# EAGLE design EtchaSketch (EAGLE 9.6.2)
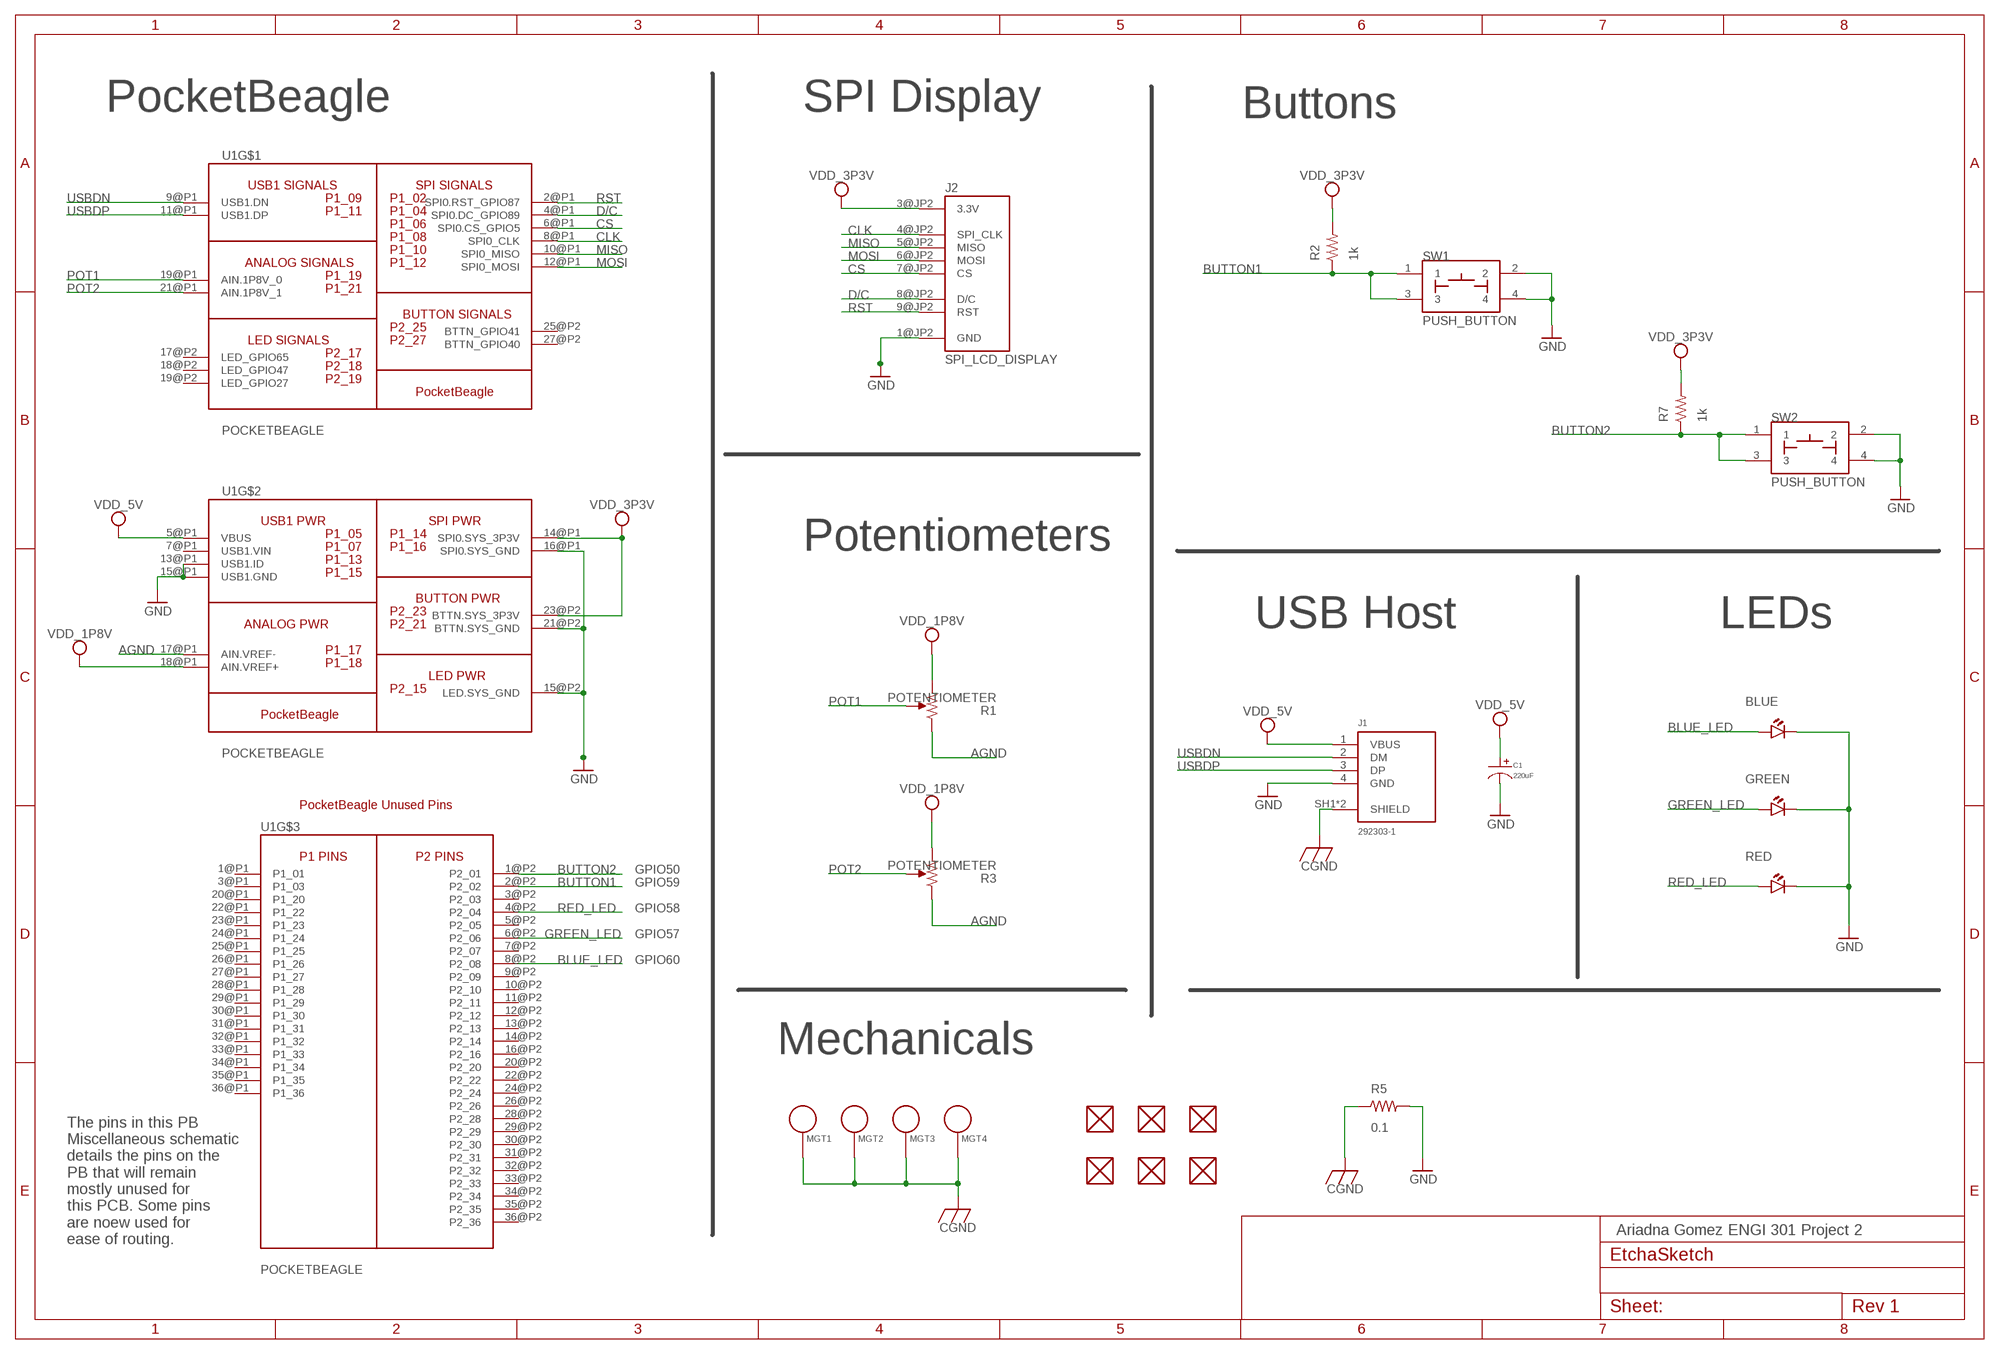
[diagram p0: schematic, sheet 1]

## Parts
BLUE  LED  [EIA-STD]
C1  220uF  CAPACITOR_P_10MM  [CP10MM]
FUD1  FIDUCIAL  [FIDUCIAL_40MIL]
FUD2  FIDUCIAL  [FIDUCIAL_40MIL]
FUD3  FIDUCIAL  [FIDUCIAL_40MIL]
FUD4  FIDUCIAL  [FIDUCIAL_40MIL]
FUD5  FIDUCIAL  [FIDUCIAL_40MIL]
FUD6  FIDUCIAL  [FIDUCIAL_40MIL]
GREEN  LED  [EIA-STD]
J1  292303-1  [TE_292303-1]
J2  SPI_LCD_DISPLAY  [SPI_LCD_DISPLAY]
MGT1  MOUNTING_HOLE  [MOUNTING_HOLE]
MGT2  MOUNTING_HOLE  [MOUNTING_HOLE]
MGT3  MOUNTING_HOLE  [MOUNTING_HOLE]
MGT4  MOUNTING_HOLE  [MOUNTING_HOLE]
R1  POTENTIOMETER  [POT-PO90S]
R2  1k  R_R0603  [R0603]
R3  POTENTIOMETER  [POT-PO90S]
R5  0.1  R_R0805  [R0805]
R7  1k  R_R0603  [R0603]
RED  LED  [EIA-STD]
SW1  PUSH_BUTTON  [BUTTON_12.5MM]
SW2  PUSH_BUTTON  [BUTTON_12.5MM]
U1  POCKETBEAGLE  [POCKETBEAGLE]

## Nets
AGND: R1.CCW R3.CCW U1.17@P1(AIN.VREF-)
BLUE_LED: BLUE.ANODE U1.8@P2(P2_08)
BUTTON1: R2.1 SW1.1 SW1.3 U1.2@P2(P2_02)
BUTTON2: R7.1 SW2.1 SW2.3 U1.1@P2(P2_01)
CGND: J1.SH1(SHIELD) J1.SH2(SHIELD) MGT1.P$1 MGT2.P$1 MGT3.P$1 MGT4.P$1 R5.1
CLK: J2.4@JP2(SPI_CLK) U1.8@P1(SPI0_CLK)
CS: J2.7@JP2(CS) U1.6@P1(SPI0.CS_GPIO5)
D/C: J2.8@JP2(D/C) U1.4@P1(SPI0.DC_GPIO89)
GND: BLUE.CATHODE C1.P$2 GREEN.CATHODE J1.4(GND) J2.1@JP2(GND) R5.2 RED.CATHODE SW1.2 SW1.4 SW2.2 SW2.4 U1.13@P1(USB1.ID) U1.15@P1(USB1.GND) U1.15@P2(LED.SYS_GND) U1.16@P1(SPI0.SYS_GND) U1.21@P2(BTTN.SYS_GND)
GREEN_LED: GREEN.ANODE U1.6@P2(P2_06)
MISO: J2.5@JP2(MISO) U1.10@P1(SPI0_MISO)
MOSI: J2.6@JP2(MOSI) U1.12@P1(SPI0_MOSI)
POT1: R1.S U1.19@P1(AIN.1P8V_0)
POT2: R3.S U1.21@P1(AIN.1P8V_1)
RED_LED: RED.ANODE U1.4@P2(P2_04)
RST: J2.9@JP2(RST) U1.2@P1(SPI0.RST_GPIO87)
USBDN: J1.2(DM) U1.9@P1(USB1.DN)
USBDP: J1.3(DP) U1.11@P1(USB1.DP)
VDD_1P8V: R1.CW R3.CW U1.18@P1(AIN.VREF+)
VDD_3P3V: J2.3@JP2(3.3V) R2.2 R7.2 U1.14@P1(SPI0.SYS_3P3V) U1.23@P2(BTTN.SYS_3P3V)
VDD_5V: C1.P$1 J1.1(VBUS) U1.5@P1(VBUS)
Unconnected: FUD1.P$1 FUD2.P$1 FUD3.P$1 FUD4.P$1 FUD5.P$1 FUD6.P$1 U1.1@P1(P1_01) U1.3@P1(P1_03) U1.3@P2(P2_03) U1.5@P2(P2_05) U1.7@P1(USB1.VIN) U1.7@P2(P2_07) U1.9@P2(P2_09) U1.10@P2(P2_10) U1.11@P2(P2_11) U1.12@P2(P2_12) U1.13@P2(P2_13) U1.14@P2(P2_14) U1.16@P2(P2_16) U1.17@P2(LED_GPIO65) U1.18@P2(LED_GPIO47) U1.19@P2(LED_GPIO27) U1.20@P1(P1_20) U1.20@P2(P2_20) U1.22@P1(P1_22) U1.22@P2(P2_22) U1.23@P1(P1_23) U1.24@P1(P1_24) U1.24@P2(P2_24) U1.25@P1(P1_25) U1.25@P2(BTTN_GPIO41) U1.26@P1(P1_26) U1.26@P2(P2_26) U1.27@P1(P1_27) U1.27@P2(BTTN_GPIO40) U1.28@P1(P1_28) U1.28@P2(P2_28) U1.29@P1(P1_29) U1.29@P2(P2_29) U1.30@P1(P1_30) U1.30@P2(P2_30) U1.31@P1(P1_31) U1.31@P2(P2_31) U1.32@P1(P1_32) U1.32@P2(P2_32) U1.33@P1(P1_33) U1.33@P2(P2_33) U1.34@P1(P1_34) U1.34@P2(P2_34) U1.35@P1(P1_35) U1.35@P2(P2_35) U1.36@P1(P1_36) U1.36@P2(P2_36)

## Notes on the sheet
- PocketBeagle | SPI Display | Buttons
- Potentiometers
- USB Host | LEDs
- GPIO50
- GPIO59
- GPIO58
- GPIO57
- GPIO60
- Mechanicals
- Ariadna Gomez ENGI 301 Project 2
- The pins in this PB 
  Miscellaneous schematic 
  details the pins on the
  PB that will remain
  mostly unused for 
  this PCB. Some pins 
  are noew used for
  ease of routing.

## Library data of the parts
BLUE GREEN RED = EtchaSketch:LED: LTST-C191 TBKT LED
C1 = EtchaSketch:CAPACITOR_P: Library: MF_Passives Description: Device for Polarized Capacitors. Manufacture part number (MPN), Voltage Rating, and Tolerance can be added via Attributes. Check https://factory.macrofab.com/parts for the house parts list.; POPULATE: 1
FUD1-FUD6 = combo_lock:FIDUCIAL
J1 = EtchaSketch:292303-1: CONN USB RECEPT R/A TYPE A 4POS Check prices <https://pricing.snapeda.com/parts/292303-1/TE%20Connectivity/view-part?ref=eda>; AVAILABILITY: In Stock; COMMENT: 292303-1; DESCRIPTION: Conn; Data; USB; Recept; 2.0; 4 Pos; 1 Port; Rt Angle; A Ser; Tin over Copper; MF: TE Connectivity; MP: 292303-1; PACKAGE: None; PRICE: None; PURCHASE-URL: https://pricing.snapeda.com/search/part/292303-1/?ref=eda
J2 = EtchaSketch:SPI_LCD_DISPLAY: 2.8" Adafruit SPI Display https://github.com/adafruit/2.8-TFT-Breakout-PCB
MGT1-MGT4 = combo_lock:MOUNTING_HOLE: Chassis Mounting Hole w/GND connection ability
R1 R3 = EtchaSketch:POTENTIOMETER: Potentiometer - Examples: P090S-14T20BR10K (987-1277-ND)
R2 R7 = EtchaSketch:R_: RESISTOR, American symbol
R5 = combo_lock:R_: RESISTOR, American symbol
SW1 SW2 = EtchaSketch:PUSH_BUTTON
U1 = EtchaSketch:POCKETBEAGLE

## Board
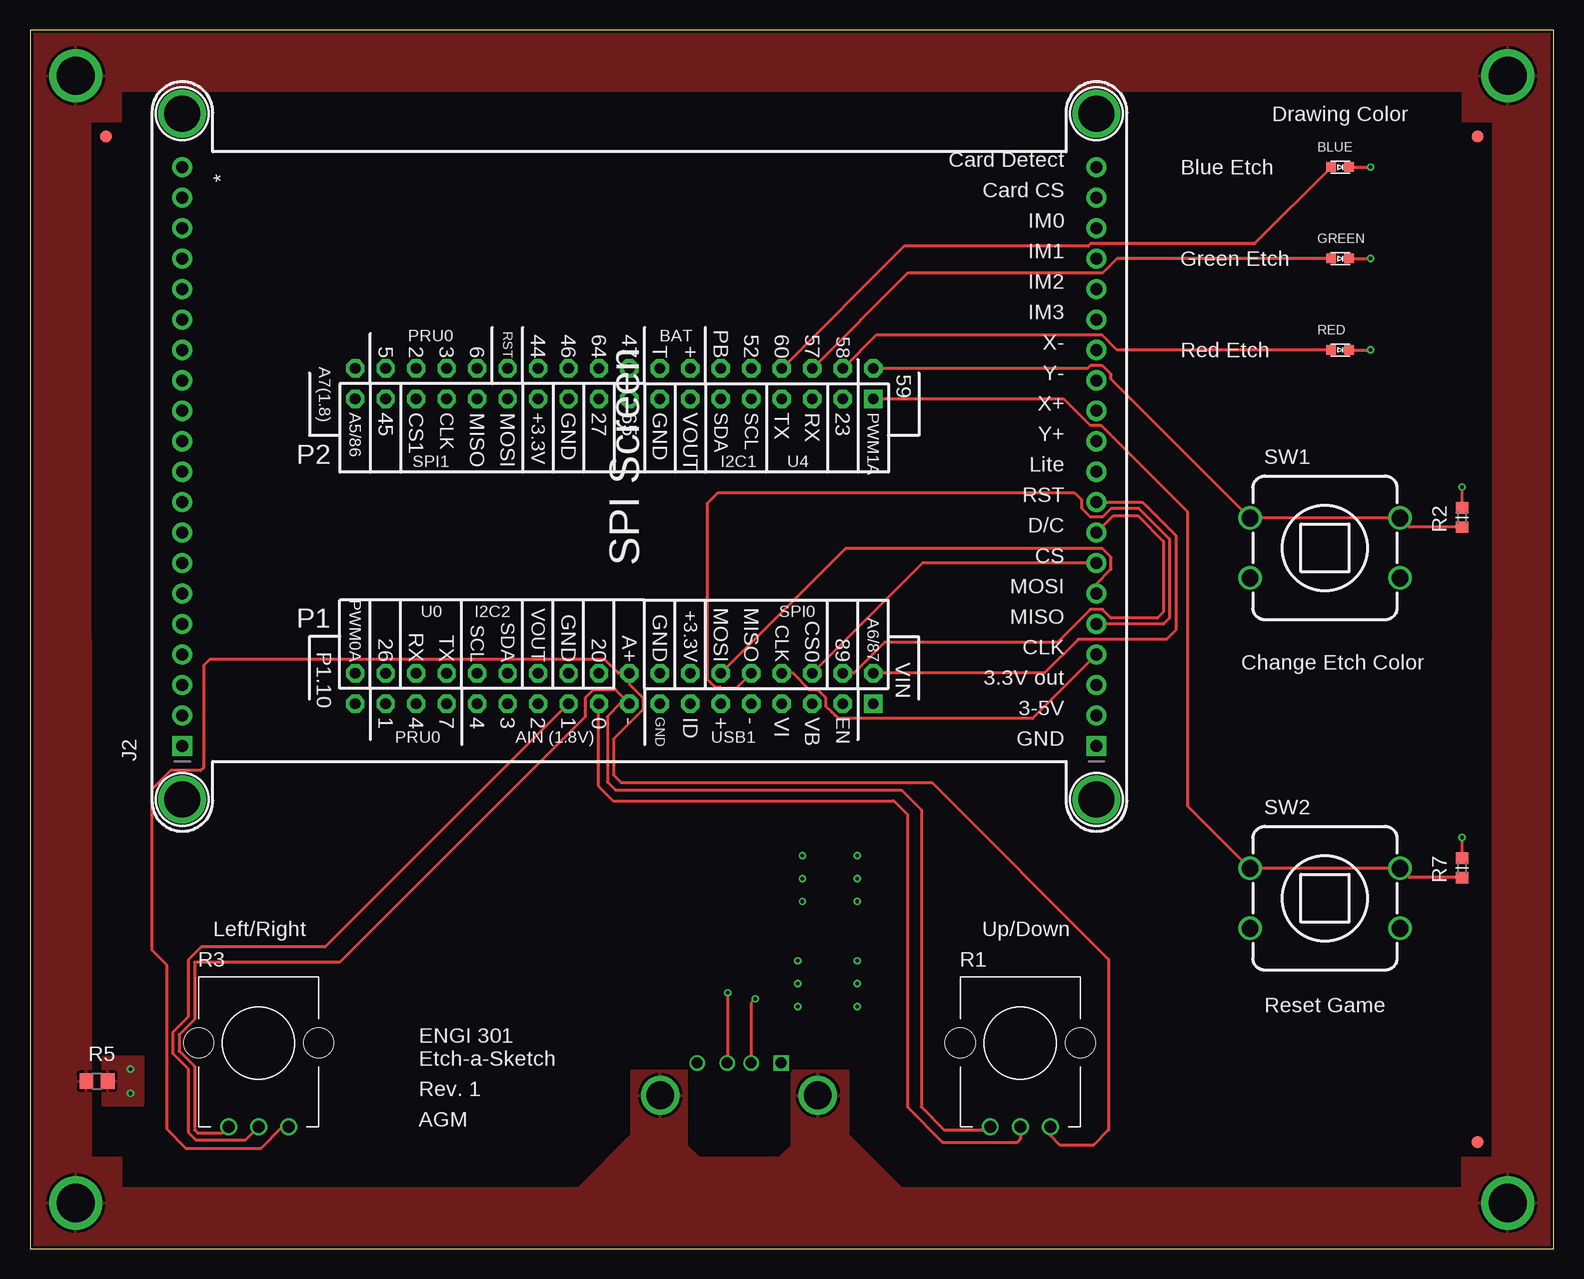
[diagram p1: board, top side]
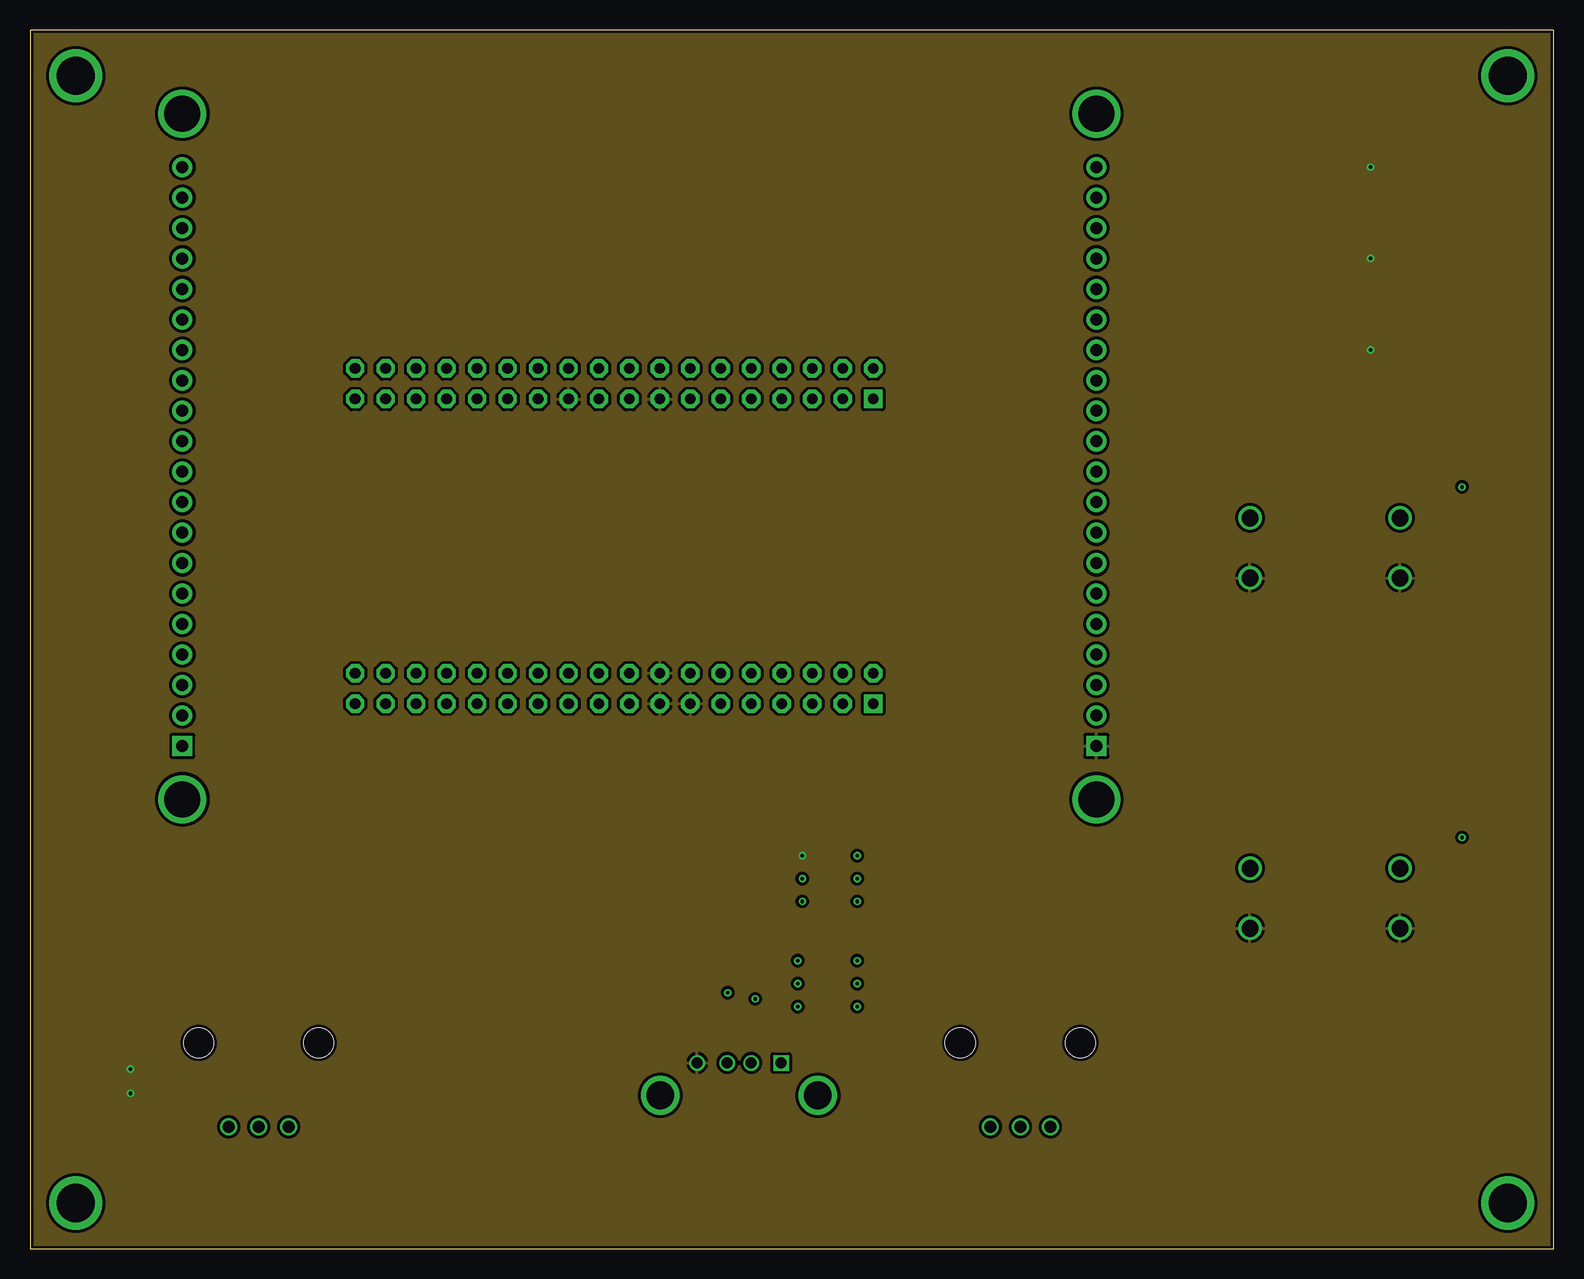
[diagram p2: board, inner layer Route2]
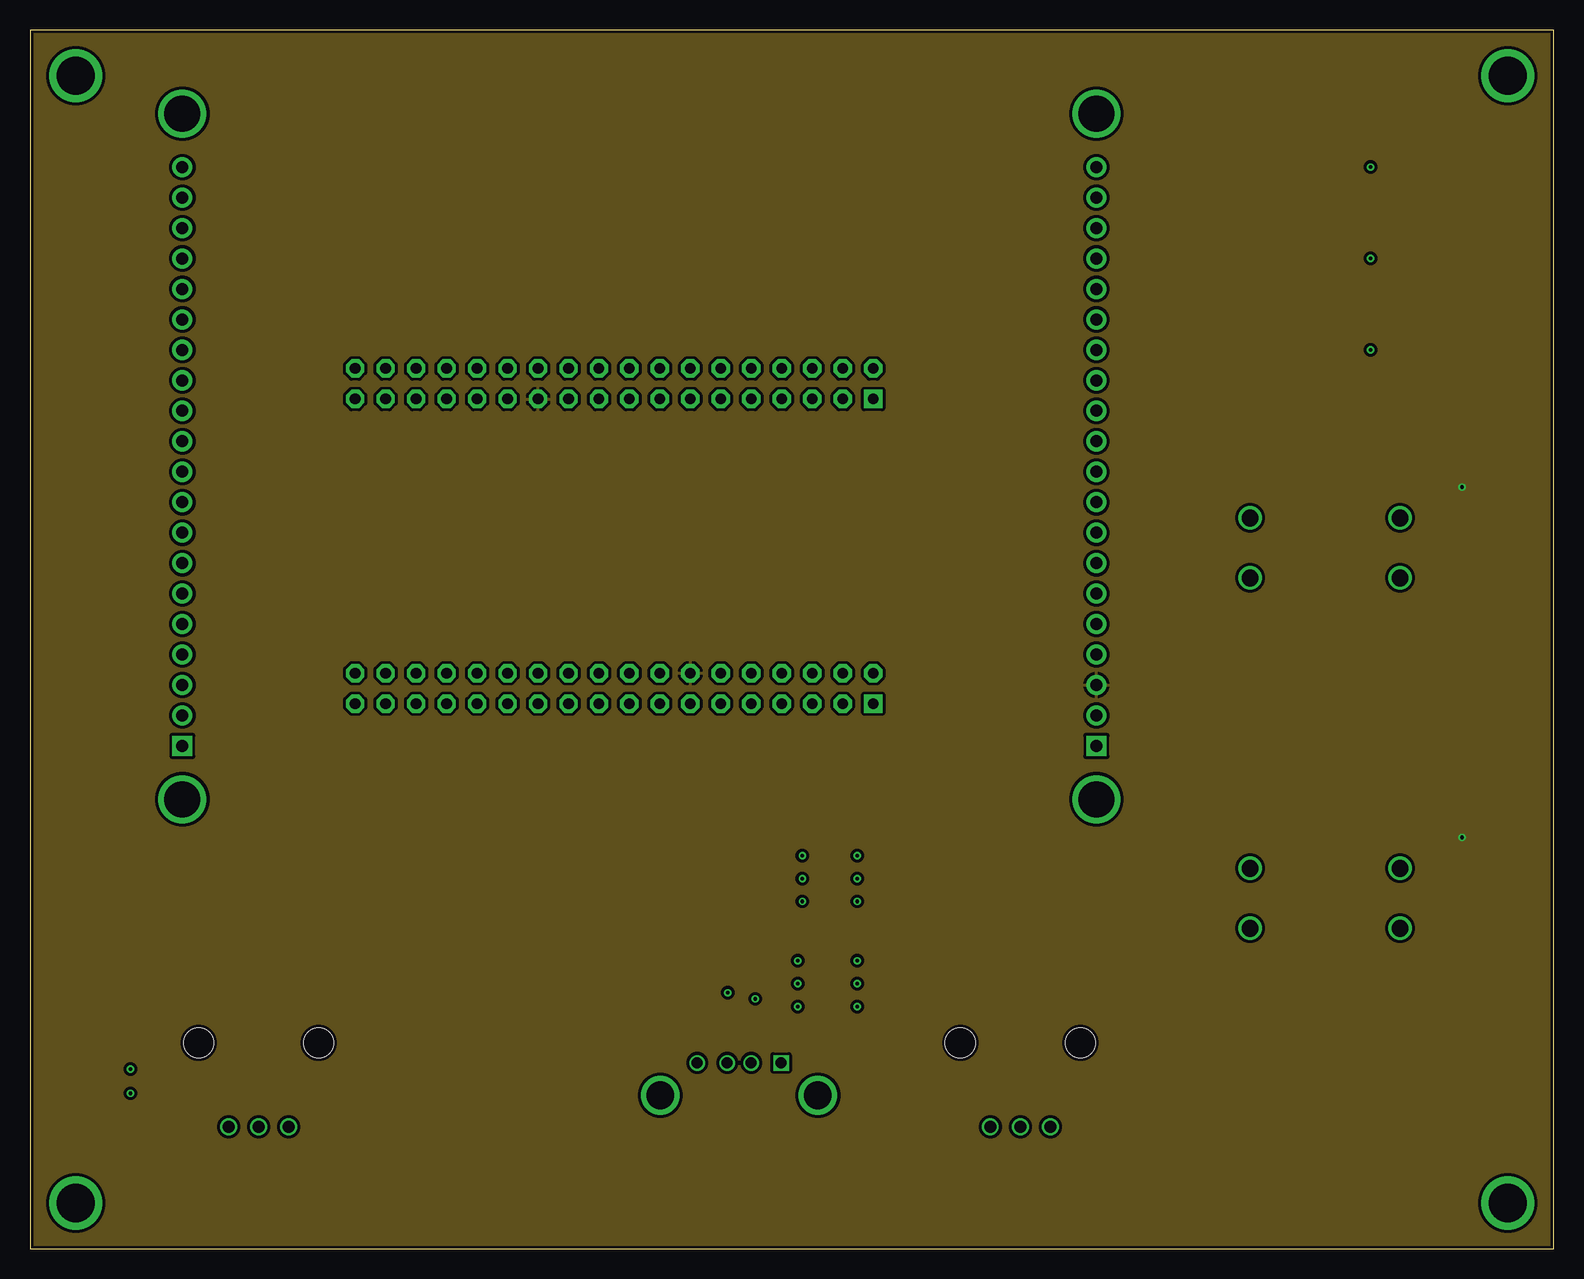
[diagram p3: board, inner layer Route15]
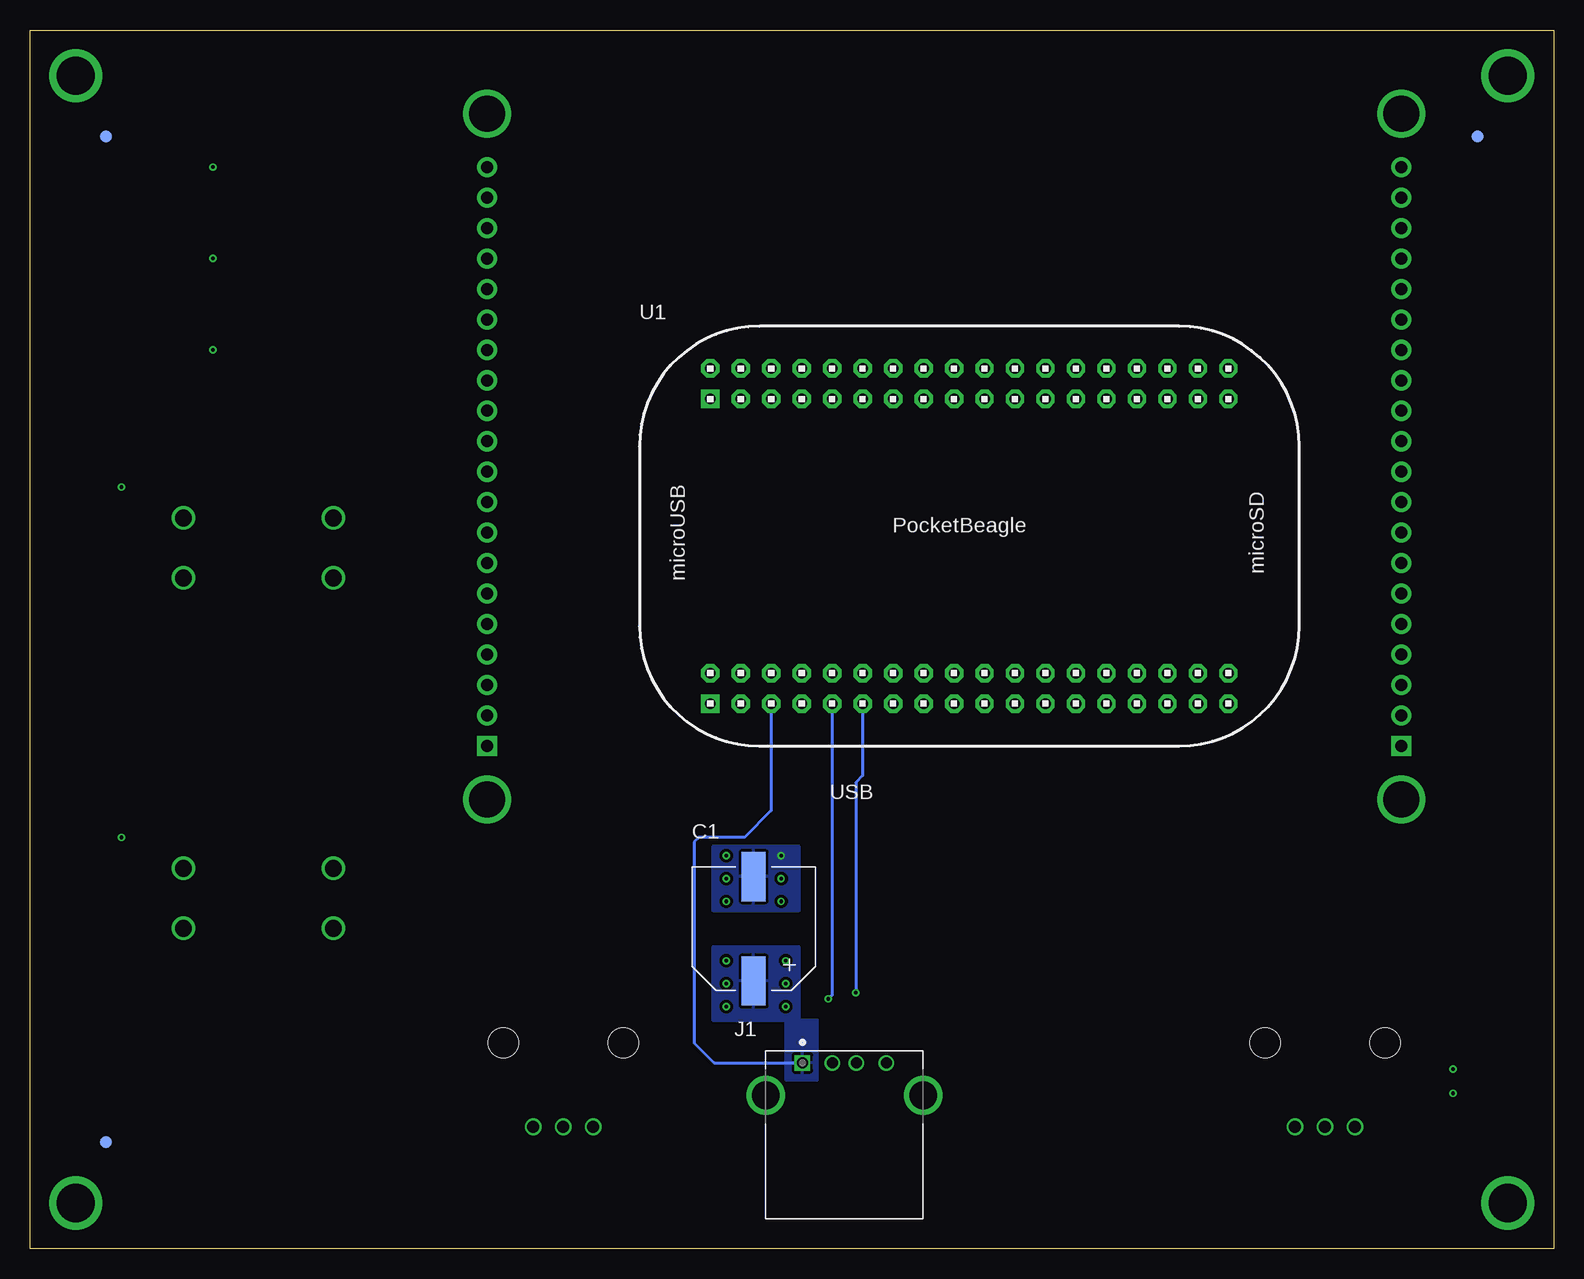
[diagram p4: board, bottom side, seen from below]

Size 127 x 101.6 mm. Coordinates in mm from the lower left corner, seen from the top.
Outline: 0,0 127,0 127,101.6 0,101.6 0,0
Copper layers (1*2*15*16): Top 0.035mm / dielectric 0.23mm / Route2 0.035mm / dielectric 0.93mm / Route15 0.035mm / dielectric 0.23mm / Bottom 0.035mm
Design rules "ENGI301_4lyr": minimum track width 10mil, minimum drill 12mil, track to track 10mil, track to pad 10mil, pad to pad 10mil, via to via 10mil, smd to smd 10mil, copper to edge 10mil, drill to drill 12mil, minimum pad ring 6mil, minimum via ring 6mil, stop-mask expansion 3mil, vias tented up to drill 25mil, thermal gap 10mil

### Footprints (pad centres in the part's own frame; a part is rotated, then mirrored left to right if it is on the bottom)
EIA-STD = smd 0.8 x 0.8: ANODE -0.75,0; CATHODE 0.75,0
CP10MM = smd 2 x 4.1: P$1 0,-4.35; P$2 0,4.35
FIDUCIAL_40MIL = smd 1.016 x 1.016: P$1 0,0
TE_292303-1 = drill 0.92 square: 1 0,0 | drill 0.92: 2 2.5,0; 3 4.5,0; 4 7,0 | drill 2.3: SH1 -3.07,-2.71; SH2 10.07,-2.71
SPI_LCD_DISPLAY = drill 1 pad 1.676 square: 1@JP1 -24.13,38.1; 1@JP2 -24.13,-38.1 | drill 1 pad 1.676: 2@JP1 -21.59,38.1; 2@JP2 -21.59,-38.1; 3@JP1 -19.05,38.1; 3@JP2 -19.05,-38.1; 4@JP1 -16.51,38.1; 4@JP2 -16.51,-38.1; 5@JP1 -13.97,38.1; 5@JP2 -13.97,-38.1; 6@JP1 -11.43,38.1; 6@JP2 -11.43,-38.1; 7@JP1 -8.89,38.1; 7@JP2 -8.89,-38.1; 8@JP1 -6.35,38.1; 8@JP2 -6.35,-38.1; 9@JP1 -3.81,38.1; 9@JP2 -3.81,-38.1; 10@JP1 -1.27,38.1; 10@JP2 -1.27,-38.1; 11@JP1 1.27,38.1; 11@JP2 1.27,-38.1; 12@JP1 3.81,38.1; 12@JP2 3.81,-38.1; 13@JP1 6.35,38.1; 13@JP2 6.35,-38.1; 14@JP1 8.89,38.1; 14@JP2 8.89,-38.1; 15@JP1 11.43,38.1; 15@JP2 11.43,-38.1; 16@JP1 13.97,38.1; 16@JP2 13.97,-38.1; 17@JP1 16.51,38.1; 17@JP2 16.51,-38.1; 18@JP1 19.05,38.1; 18@JP2 19.05,-38.1; 19@JP1 21.59,38.1; 19@JP2 21.59,-38.1; 20@JP1 24.13,38.1; 20@JP2 24.13,-38.1 | drill 3 pad 3.6: P$1@U$7 -28.575,-38.1; P$1@U$15 28.575,-38.1; P$1@U$16 -28.575,38.1; P$1@U$17 28.575,38.1
MOUNTING_HOLE = drill 3.175 pad 4.445: P$1 0,0
POT-PO90S = drill 1: CCW -2.5,0; CW 2.5,0; S 0,0 | hole 2.5: -5,7; 5,7
R0603 = smd 0.95 x 1.031: 1 -0.8,0; 2 0.8,0
R0805 = smd 1.143 x 1.27: 1 -0.889,0; 2 0.889,0
BUTTON_12.5MM = drill 1.4: 1 -6.25,2.5; 2 -6.25,-2.5; 3 6.25,2.5; 4 6.25,-2.5
POCKETBEAGLE = drill 0.889 pad 1.524 square: 1@P1 5.91,3.53; 1@P2 5.91,28.93 | drill 0.889 pad 1.524 octagon: 2@P1 5.91,6.07; 2@P2 5.91,31.47; 3@P1 8.45,3.53; 3@P2 8.45,28.93; 4@P1 8.45,6.07; 4@P2 8.45,31.47; 5@P1 10.99,3.53; 5@P2 10.99,28.93; 6@P1 10.99,6.07; 6@P2 10.99,31.47; 7@P1 13.53,3.53; 7@P2 13.53,28.93; 8@P1 13.53,6.07; 8@P2 13.53,31.47; 9@P1 16.07,3.53; 9@P2 16.07,28.93; 10@P1 16.07,6.07; 10@P2 16.07,31.47; 11@P1 18.61,3.53; 11@P2 18.61,28.93; 12@P1 18.61,6.07; 12@P2 18.61,31.47; 13@P1 21.15,3.53; 13@P2 21.15,28.93; 14@P1 21.15,6.07; 14@P2 21.15,31.47; 15@P1 23.69,3.53; 15@P2 23.69,28.93; 16@P1 23.69,6.07; 16@P2 23.69,31.47; 17@P1 26.23,3.53; 17@P2 26.23,28.93; 18@P1 26.23,6.07; 18@P2 26.23,31.47; 19@P1 28.77,3.53; 19@P2 28.77,28.93; 20@P1 28.77,6.07; 20@P2 28.77,31.47; 21@P1 31.31,3.53; 21@P2 31.31,28.93; 22@P1 31.31,6.07; 22@P2 31.31,31.47; 23@P1 33.85,3.53; 23@P2 33.85,28.93; 24@P1 33.85,6.07; 24@P2 33.85,31.47; 25@P1 36.39,3.53; 25@P2 36.39,28.93; 26@P1 36.39,6.07; 26@P2 36.39,31.47; 27@P1 38.93,3.53; 27@P2 38.93,28.93; 28@P1 38.93,6.07; 28@P2 38.93,31.47; 29@P1 41.47,3.53; 29@P2 41.47,28.93; 30@P1 41.47,6.07; 30@P2 41.47,31.47; 31@P1 44.01,3.53; 31@P2 44.01,28.93; 32@P1 44.01,6.07; 32@P2 44.01,31.47; 33@P1 46.55,3.53; 33@P2 46.55,28.93; 34@P1 46.55,6.07; 34@P2 46.55,31.47; 35@P1 49.09,3.53; 35@P2 49.09,28.93; 36@P1 49.09,6.07; 36@P2 49.09,31.47

### Placement (x,y rotation side)
BLUE  109.22,90.17 0 top
C1  66.67,26.67 0 bottom
FUD1  120.65,8.89 0 top
FUD2  6.35,92.71 0 top
FUD3  120.65,8.89 0 bottom
FUD4  120.65,92.71 0 bottom
FUD5  6.35,92.71 0 bottom
FUD6  120.65,92.71 0 top
GREEN  109.22,82.55 0 top
J1  62.61,15.49 0 bottom
J2  50.8,66.04 90 top
MGT1  3.81,97.79 0 top
MGT2  123.19,3.81 0 top
MGT3  3.81,3.81 0 top
MGT4  123.19,97.79 0 top
R1  82.55,10.16 0 top
R2  119.38,60.96 90 top
R3  19.05,10.16 0 top
R5  5.59,13.97 0 top
R7  119.38,31.75 90 top
RED  109.22,74.93 0 top
SW1  107.95,58.42 0 top
SW2  107.95,29.21 0 top
U1  76.2,41.91 0 bottom

### Tracks (layer width: path | path; a pad name or v marks a point on that pad's centre or on a via)
AGND
  Top 0.254: R3.CCW 16.04,9.65 13.97,9.65 13.72,9.91 13.72,15.19 12.42,16.48 12.42,17.84 13.72,19.13 13.72,23.88 25.81,23.88 46.29,44.35 46.29,45.91 46.96,46.58 48.83,46.58 U1.17@P1 49.21,45.44 48.13,44.37 48.13,38.91 48.81,38.23 72.64,38.23 74.3,36.58 74.3,11.81 76.2,9.91 79.8,9.91 R1.CCW
BLUE_LED
  Top 0.254: BLUE.ANODE 102.07,83.77 88.39,83.77 88.19,83.57 72.86,83.57 U1.8@P2
BUTTON1
  Top 0.254: R2.1 114.96,60.16 SW1.3 SW1.1 90.12,72.5 90.12,72.89 89.41,73.61 88.39,73.61 88.17,73.38 U1.2@P2
BUTTON2
  Top 0.254: R7.1 114.96,30.95 SW2.3 SW2.1 96.52,36.89 96.52,61.41 89.3,68.63 88.39,68.63 86.19,70.84 U1.1@P2
CGND
  pour Top: -2.54,-2.54 -2.54,50.8 5.08,50.8 5.08,7.62 7.62,7.62 7.62,5.08 45.72,5.08 50.16,9.53 50.16,14.86 54.74,14.86 54.74,8.64 55.75,7.62 62.48,7.62 63.5,8.64 63.5,14.86 68.2,14.86 68.2,9.53 72.64,5.08 119.38,5.08 119.38,7.62 121.92,7.62 121.92,50.8 129.54,50.8 129.54,-2.54
  pour Top: -2.54,104.14 -2.54,50.8 5.08,50.8 5.08,93.98 7.62,93.98 7.62,96.52 119.38,96.52 119.38,93.98 121.92,93.98 121.92,50.8 129.54,50.8 129.54,104.14
CLK
  Top 0.254: J2.4@JP2 83.57,44.2 67.38,44.2 67.09,44.48 66.84,44.74 66.35,45.22 66.35,45.91 65.68,46.58 64.99,46.58 63.59,47.98 U1.8@P1
CS
  Top 0.254: J2.7@JP2 74.38,57.15 U1.6@P1
D/C
  Top 0.254: J2.8@JP2 90.32,61.11 92.35,61.11 94.49,58.97 94.49,53.09 93.98,52.58 90.12,52.58 89.41,53.29 88.39,53.29 85.65,50.55 71.24,50.55 68.67,47.98 U1.4@P1
GND  (via drill 0.3 pad 0.61)
  Top 0.254: BLUE.CATHODE v111.76,90.17 | GREEN.CATHODE v111.76,82.55 | RED.CATHODE v111.76,74.93
  other vias: 8.38,12.95 8.38,14.99 64.39,32.77
  pour Route2: -5.08,106.68 132.08,106.68 132.08,-5.08 -5.08,-5.08
  pour Top: 6.1,13.97 6.1,16 9.4,16 9.4,11.94 6.1,11.94
  pour Bottom: 62.87,33.53 70.1,33.53 70.1,28.19 62.87,28.19
GND1  (via drill 0.3 pad 0.61)
  other vias: 64.39,30.86
GND2  (via drill 0.3 pad 0.61)
  other vias: 64.39,28.96
GND3  (via drill 0.3 pad 0.61)
  other vias: 68.96,32.77
GND4  (via drill 0.3 pad 0.61)
  other vias: 68.96,30.86
GND5  (via drill 0.3 pad 0.61)
  other vias: 68.96,28.96
GREEN_LED
  Top 0.254: GREEN.ANODE 90.62,82.55 89.41,81.33 73.16,81.33 U1.6@P2
MISO
  Top 0.254: J2.5@JP2 94.49,52.07 95,52.58 95,59.18 92.46,61.72 90.12,61.72 89.41,61.01 88.39,61.01 87.68,61.73 87.68,62.43 87.12,62.99 57.3,62.99 56.45,62.13 56.45,47.51 57.12,46.84 57.56,46.84 57.66,46.74 58.89,46.74 U1.10@P1
MOSI
  Top 0.254: U1.12@P1 67.98,58.37 89.41,58.37 90.12,57.66 90.12,56.65 88.9,55.43 J2.6@JP2
POT1
  Top 0.254: R1.S 82.55,9.14 82.3,8.89 76.07,8.89 73.15,11.81 73.15,36.2 72.01,37.34 48.6,37.34 47.36,38.58 47.36,45.37 U1.19@P1
POT2
  Top 0.254: U1.21@P1 24.6,25.15 14.27,25.15 13.21,24.09 13.21,19.34 11.91,18.05 11.91,16.27 13.21,14.98 13.21,9.7 13.82,9.08 17.97,9.08 R3.S
RED_LED
  Top 0.254: RED.ANODE 90.62,74.93 89.41,76.15 70.52,76.15 U1.4@P2
RST
  Top 0.254: J2.9@JP2 92.71,62.23 95.5,59.44 95.5,51.56 94.74,50.8 87.38,50.8 84.56,47.98 U1.2@P1
USBDN  (via drill 0.3 pad 0.61)
  Top 0.254: v60.45,20.83 60.11,20.49 J1.2
  Bottom 0.254: v60.45,20.83 60.13,21.15 U1.9@P1
USBDP  (via drill 0.3 pad 0.61)
  Top 0.254: v58.17,21.34 58.17,15.55 J1.3
  Bottom 0.254: U1.11@P1 57.59,39.44 58.17,38.86 v58.17,21.34
VDD_1P8V
  Top 0.254: R1.CW 85.05,9.44 85.85,8.64 88.65,8.64 89.92,9.91 89.92,24.13 75.18,38.86 49.28,38.86 48.64,39.5 48.64,42.49 51.11,44.97 51.11,45.91 49.97,47.06 U1.18@P1 49.05,47.98 47.91,49.12 14.99,49.12 14.48,48.62 14.48,40.13 14.2,39.85 11.71,39.85 10.16,38.3 10.16,24.89 11.4,23.65 11.4,9.98 13,8.38 19.26,8.38 21.04,10.16 R3.CW
VDD_3P3V  (via drill 0.3 pad 0.61)
  Top 0.254: R7.2 v119.38,34.29 | R2.2 v119.38,63.5
  pour Route15 (rank 6): -7.62,109.22 134.62,109.22 134.62,-7.62 -7.62,-7.62
VDD_5V
  Bottom 0.254: U1.5@P1 65.21,36.52 67.44,34.29 71.25,34.29 71.63,33.91 71.63,17.14 69.98,15.49 J1.1
  pour Bottom: 62.87,19.05 62.87,25.15 70.1,25.15 70.1,19.05 64.01,19.05 64.01,14.1 61.34,14.1 61.34,19.05
VDD_5V1  (via drill 0.3 pad 0.61)
  other vias: 64.01,20.19
VDD_5V2  (via drill 0.3 pad 0.61)
  other vias: 64.01,22.1
VDD_5V3  (via drill 0.3 pad 0.61)
  other vias: 68.96,24
VDD_5V4  (via drill 0.3 pad 0.61)
  other vias: 68.96,22.1
VDD_5V5  (via drill 0.3 pad 0.61)
  other vias: 68.96,20.19
VDD_5V6  (via drill 0.3 pad 0.61)
  other vias: 64.01,24

### Text on the board
tPlace: Drawing Color | Blue Etch | Green Etch | Red Etch | Change Etch Color | Left/Right | Up/Down | Reset Game | ENGI 301 / Etch-a-Sketch | Rev. 1 | AGM
bPlace: USB